# Altium project AMC_FMC_Carrier v3.PrjPcb (part 11 of 15)

## Sheet JTAG_Configuration.SchDoc
size A4; DocumentNumber: 8; SheetNumber: 8; SheetTotal: 30
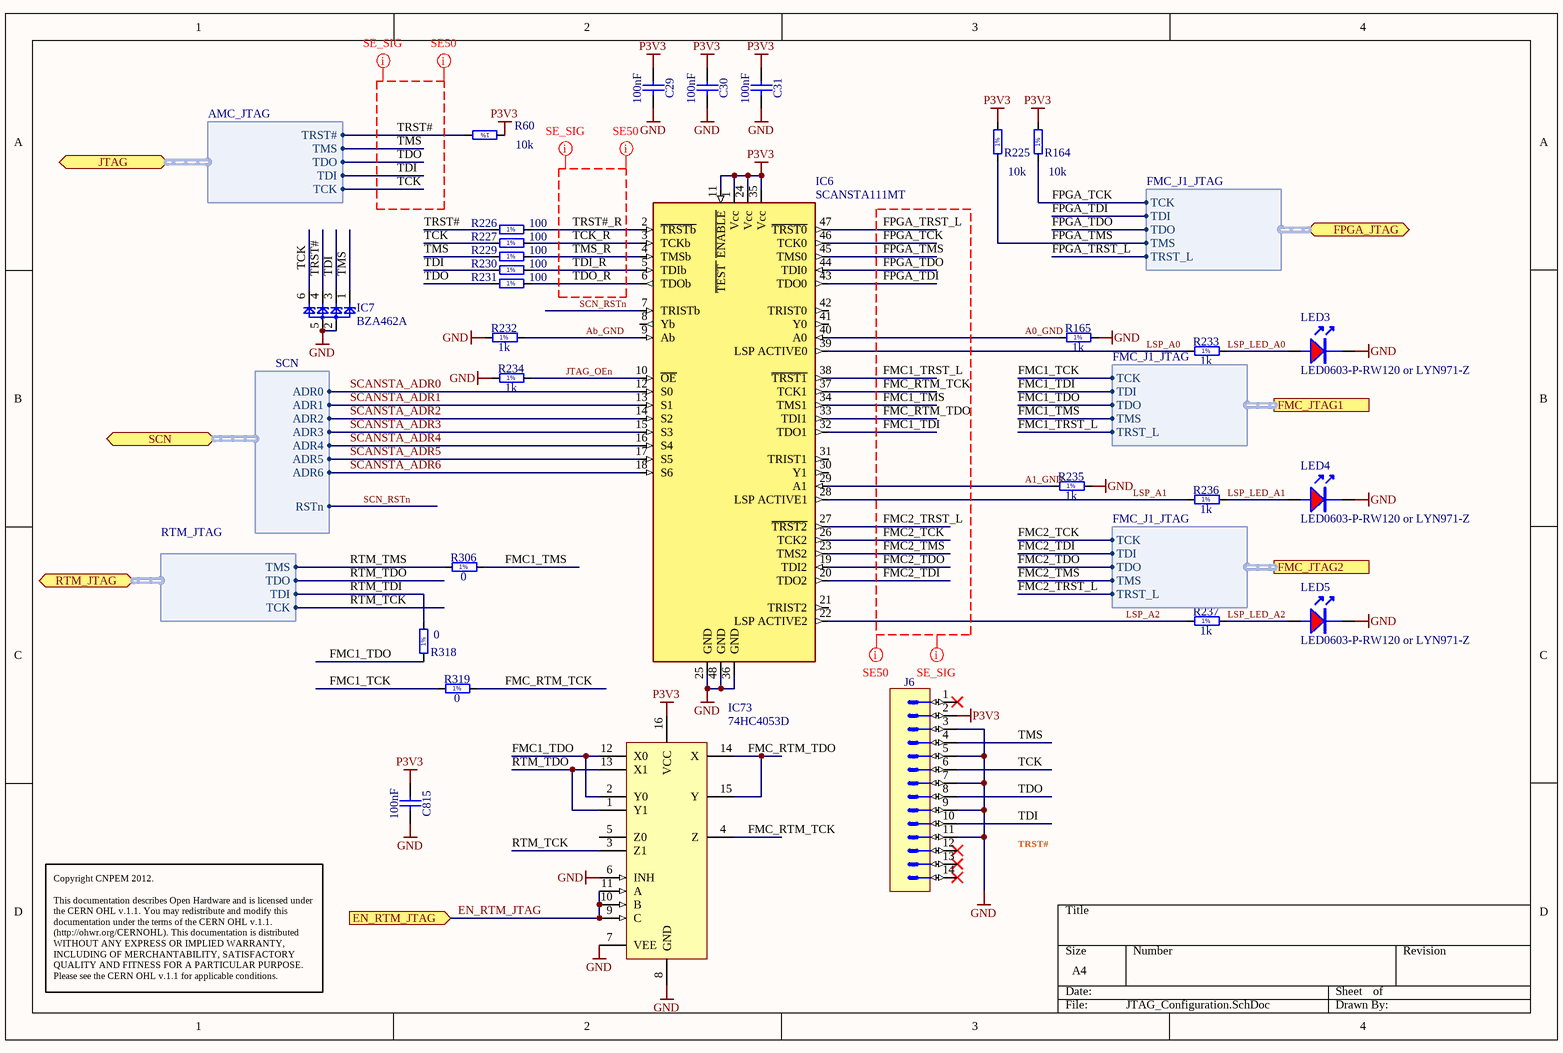
[diagram p25: JTAG_Configuration.SchDoc]

### Parts
C29  100nF  [CAPC0603X33N]
C30  100nF  [CAPC0603X33N]
C31  100nF  [CAPC0603X33N]
C815  100nF  [CAPC0603X33N]
IC6  SCANSTA111MT  [TSSOP-48]
IC7  BZA462A  [SOT23-6]
IC73  74HC4053D  [SO-16]
J6  Milli-Grid™  [MOLEX_87832-1420]  (value not drawn)
LED3  LED0603-P-RW120 or LYN971-Z  [led_0603R]
LED4  LED0603-P-RW120 or LYN971-Z  [led_0603R]
LED5  LED0603-P-RW120 or LYN971-Z  [led_0603R]
R60  10k  [RESC1005X40N]
R164  10k  [RESC1005X40N]
R165  1k  [RESC1005X40N]
R225  10k  [RESC1005X40N]
R226  100  [RESC1005X40N]
R227  100  [RESC1005X40N]
R229  100  [RESC1005X40N]
R230  100  [RESC1005X40N]
R231  100  [RESC1005X40N]
R232  1k  [RESC1005X40N]
R233  1k  [RESC1005X40N]
R234  1k  [RESC1005X40N]
R235  1k  [RESC1005X40N]
R236  1k  [RESC1005X40N]
R237  1k  [RESC1005X40N]
R306  0  [RESC1005X40N]
R318  0  [RESC1005X40N]
R319  0  [RESC1005X40N]

### Ports
EN_RTM_JTAG (in), FMC_JTAG1 (harness FMC_J1_JTAG), FMC_JTAG2 (harness FMC_J1_JTAG), FPGA_JTAG (harness FMC_J1_JTAG), JTAG (harness AMC_JTAG), RTM_JTAG (harness RTM_JTAG), SCN (harness SCN)

### Harnesses
FMC_J1_JTAG: TCK, TDI, TDO, TMS, TRST_L
AMC_JTAG: TCK, TDI, TDO, TMS, TRST#
SCN: ADR0, ADR1, ADR2, ADR3, ADR4, ADR5, ADR6, RSTn
RTM_JTAG: TCK, TDI, TDO, TMS

### Nets
GND: C29.2 C30.2 C31.2 C815.2 IC6.25(GND) IC6.36(GND) IC6.48(GND) IC7.2 IC7.5 IC73.6(INH) IC73.7(VEE) IC73.8(GND) J6.3 J6.5 J6.7 J6.9 J6.11 LED3.K LED4.K LED5.K R165.2 R232.1 R234.1 R235.2
P3V3: C29.1 C30.1 C31.1 C815.1 IC6.1(Vcc) IC6.11(~{TEST_}_~{ENABLE}) IC6.24(Vcc) IC6.35(Vcc) IC73.16(VCC) J6.2 R60.1 R164.2 R225.2
A0_GND: IC6.40(A0) R165.1
A1_GND: IC6.29(A1) R235.1
Ab_GND: IC6.9(Ab) R232.2
EN_RTM_JTAG: IC73.9(C) IC73.10(B) IC73.11(A) ; port EN_RTM_JTAG  [project net EN_I2C_RTM]
FMC1_TCK: R319.1 ; port FMC_JTAG1.TCK  [project net JTAG1.TCK]
FMC1_TDI: IC6.32(TDO1) ; port FMC_JTAG1.TDI  [project net JTAG1.TDI]
FMC1_TDO: IC73.2(Y0) IC73.12(X0) R318.1 ; port FMC_JTAG1.TDO  [project net JTAG1.TDO]
FMC1_TMS: IC6.34(TMS1) R306.2 ; port FMC_JTAG1.TMS  [project net JTAG1.TMS]
FMC1_TRST_L: IC6.38(~{TRST1}) ; port FMC_JTAG1.TRST_L  [project net JTAG1.TRST_L]
FMC2_TCK: IC6.26(TCK2) ; port FMC_JTAG2.TCK  [project net JTAG2.TCK]
FMC2_TDI: IC6.20(TDO2) ; port FMC_JTAG2.TDI  [project net JTAG2.TDI]
FMC2_TDO: IC6.19(TDI2) ; port FMC_JTAG2.TDO  [project net JTAG2.TDO]
FMC2_TMS: IC6.23(TMS2) ; port FMC_JTAG2.TMS  [project net JTAG2.TMS]
FMC2_TRST_L: IC6.27(~{TRST2}) ; port FMC_JTAG2.TRST_L  [project net JTAG2.TRST_L]
FMC_RTM_TCK: IC6.37(TCK1) IC73.4(Z) R319.2
FMC_RTM_TDO: IC6.33(TDI1) IC73.14(X) IC73.15(Y)
FPGA_TCK: IC6.46(TCK0) R164.1 ; port FPGA_JTAG.TCK  [project net FJTAG.TCK]
FPGA_TDI: IC6.43(TDO0) ; port FPGA_JTAG.TDI  [project net FJTAG.TDI]
FPGA_TDO: IC6.44(TDI0) ; port FPGA_JTAG.TDO  [project net FJTAG.TDO]
FPGA_TMS: IC6.45(TMS0) R225.1 ; port FPGA_JTAG.TMS  [project net FJTAG.TMS]
FPGA_TRST_L: IC6.47(~{TRST0}) ; port FPGA_JTAG.TRST_L  [project net FJTAG.TRST_L]
JTAG_OEn: IC6.10(~{OE}) R234.2
LSP_A0: IC6.39(LSP_ACTIVE0) R233.1
LSP_A1: IC6.28(LSP_ACTIVE1) R236.1
LSP_A2: IC6.22(LSP_ACTIVE2) R237.1
LSP_LED_A0: LED3.A R233.2
LSP_LED_A1: LED4.A R236.2
LSP_LED_A2: LED5.A R237.2
RTM_TCK: IC73.3(Z1) ; port RTM_JTAG.TCK
RTM_TDI: R318.2 ; port RTM_JTAG.TDI
RTM_TDO: IC73.1(Y1) IC73.13(X1) ; port RTM_JTAG.TDO
RTM_TMS: R306.1 ; port RTM_JTAG.TMS
SCANSTA_ADR0: IC6.12(S0) ; port SCN.ADR0  [project net SCN.ADR0]
SCANSTA_ADR1: IC6.13(S1) ; port SCN.ADR1  [project net SCN.ADR1]
SCANSTA_ADR2: IC6.14(S2) ; port SCN.ADR2  [project net SCN.ADR2]
SCANSTA_ADR3: IC6.15(S3) ; port SCN.ADR3  [project net SCN.ADR3]
SCANSTA_ADR4: IC6.16(S4) ; port SCN.ADR4  [project net SCN.ADR4]
SCANSTA_ADR5: IC6.17(S5) ; port SCN.ADR5  [project net SCN.ADR5]
SCANSTA_ADR6: IC6.18(S6) ; port SCN.ADR6  [project net SCN.ADR6]
SCN_RSTn: IC6.7(TRISTb) ; port SCN.RSTn  [project net SCN.RSTn]
TCK: IC7.6 J6.6 R227.1 ; port JTAG.TCK  [project net AJTAG.TCK]
TCK_R: IC6.3(TCKb) R227.2
TDI: IC7.3 J6.10 R230.1 ; port JTAG.TDI  [project net AJTAG.TDI]
TDI_R: IC6.5(TDIb) R230.2
TDO: J6.8 R231.1 ; port JTAG.TDO  [project net AJTAG.TDO]
TDO_R: IC6.6(TDOb) R231.2
TMS: IC7.1 J6.4 R229.1 ; port JTAG.TMS  [project net AJTAG.TMS]
TMS_R: IC6.4(TMSb) R229.2
TRST#: IC7.4 R60.2 R226.1 ; port JTAG.TRST#  [project net AJTAG.TRST#]
TRST#_R: IC6.2(~{TRSTb}) R226.2

Not connected (* = marked no-connect by the designer): IC6 8(Yb) 21(TRIST2) 30(Y1) 31(TRIST1) 41(Y0) 42(TRIST0); IC73 5(Z0); J6 1* 12* 13* 14*

### Layout directives
net class SE_SIG: FMC1_TDI, FMC1_TMS, FMC1_TRST_L, FMC2_TCK, FMC2_TDI, FMC2_TDO, FMC2_TMS, FMC2_TRST_L, FMC_RTM_TCK, FMC_RTM_TDO, FPGA_TCK, FPGA_TDI, FPGA_TDO, FPGA_TMS, FPGA_TRST_L, TCK, TCK_R, TDI, TDI_R, TDO, TDO_R, TMS, TMS_R, TRST#, TRST#_R
net class SE50: FMC1_TDI, FMC1_TMS, FMC1_TRST_L, FMC2_TCK, FMC2_TDI, FMC2_TDO, FMC2_TMS, FMC2_TRST_L, FMC_RTM_TCK, FMC_RTM_TDO, FPGA_TCK, FPGA_TDI, FPGA_TDO, FPGA_TMS, FPGA_TRST_L, TCK, TCK_R, TDI, TDI_R, TDO, TDO_R, TMS, TMS_R, TRST#, TRST#_R

### Notes on the sheet
- TRST#
- Copyright CNPEM 2012.
  This documentation describes Open Hardware and is licensed under the CERN OHL v.1.1. You may redistribute and modify this documentation under the terms of the CERN OHL v.1.1. (http://ohwr.org/CERNOHL). This documentation is distributed WITHOUT ANY EXPRESS OR IMPLIED WARRANTY, INCLUDING OF MERCHANTABILITY, SATISFACTORY QUALITY AND FITNESS FOR A PARTICULAR PURPOSE. Please see the CERN OHL v.1.1 for applicable conditions.
- (in symbol R0402_0R_JUMPER) 1%
- (in symbol R0402_1K_1%_0.0625W_100PPM) 1%
- (in symbol R0402_10K_1%_0.0625W_100PPM) 1%
- (in symbol R0402_100R_1%_0.0625W_100PPM) 1%

### Library data of the parts
C29-C31 C815 = CC0201_100NF_6.3V_10%_X5R: as C776 on sheet IPMI; Part Number: CC0201_100NF_6.3V_10%_X5R; Component Kind: Standard; Component Type: Standard; Pin Count: 2; Value: 100nF; Status: Not Recommended; Manufacturer Part Number: CC0201_100NF_6.3V_10%_X5R; Case: 0201; Mounted: Yes; Socket: No; SMD: Yes; Manufacturer1 Example: AVX; Manufacturer1 ComponentHeight: 0.33mm; HelpURL: \\cern.ch\dfs\Applications\Altium\Datasheets\CC0201_X5R_AVX.pdf; Author: CERN DEM JLC; CreateDate: 2007-12-03; LatestRevisionDate: 2007-12-03
IC6 = IFC_SCANSTA111: Enhanced SCAN Bridge Multidrop Addressable IEEE 1149.1 (JTAG) Port; Supplier 1: Digi-Key; Supplier Part Number 1: SCANSTA111MT-ND
IC7 = D_TVS_BZA462A: as IC4 on sheet CPU; Supplier 1: Newark; Supplier Part Number 1: 79R1868
IC73 = 4053
J6 = MOLEX_87832-1420: Connector 14 Male; Part Description: 2.00mm (.079") Pitch Milli-Grid™ Header, Surface Mount, Vertical, Shrouded, 14 Circuits,with Locking Windows and Centre Polarization Slot, PCB Locator; Manufacturer: MOLEX; Part Number: MOLEX_87832-1420; Component Kind: Standard; Component Type: Standard; Pin Count: 14; Family: Milli-Grid™; Mounted: Yes; Socket: No; SMD: Yes; Status: None; Manufacturer Part Number: 87832-1420; ComponentHeight: 6.4mm; HelpURL: \\cern.ch\dfs\Applications\Altium\Datasheets\MOLEX_87832-1420.pdf; Author: CERN DEM JLC; CreateDate: 2008-09-09; LatestRevisionDate: 2008-09-09; Table: MOLEX
LED3-LED5 = LED_0603R: LED 0603 red; Supplier 1: Newark; Supplier Part Number 1: 22M3004
R60 R164 R225 = R0402_10K_1%_0.0625W_100PPM: as R2-R6 on sheet CPU; Part Number: R0402_10K_1%_0.0625W_100PPM; Component Kind: Standard; Component Type: Standard; Pin Count: 2; Value: 10k; Status: Not recommended; Power: 0.0625W; Tolerance: ±1%; Manufacturer Part Number: R0402_10K_1%_0.0625W_100PPM; Case: 0402; Mounted: Yes; Socket: No; SMD: Yes; Manufacturer1 Example: YAGEO PHYCOMP; Manufacturer1 ComponentHeight: 0.4mm; HelpURL: \\cern.ch\dfs\Applications\Altium\Datasheets\R0402_Phycomp_RC0402.pdf; Author: CERN DEM JLC; CreateDate: 2007-12-03; LatestRevisionDate: 2012-10-17
R165 R232-R237 = R0402_1K_1%_0.0625W_100PPM: Resistor - 1%; Part Description: General Purpose Thick Film Chip Resistor; Manufacturer: GENERIC; Manufacturer1 Part Number: 232270671002L; TC: ±100ppm/°C; Table: Resistors SMD; Part Number: R0402_1K_1%_0.0625W_100PPM; Component Kind: Standard; Component Type: Standard; Pin Count: 2; Value: 1k; Status: Not recommended; Power: 0.0625W; Tolerance: ±1%; Manufacturer Part Number: R0402_1K_1%_0.0625W_100PPM; Case: 0402; Mounted: Yes; Socket: No; SMD: Yes; Manufacturer1 Example: YAGEO PHYCOMP; Manufacturer1 ComponentHeight: 0.4mm; HelpURL: \\cern.ch\dfs\Applications\Altium\Datasheets\R0402_Phycomp_RC0402.pdf; Author: CERN DEM JLC; CreateDate: 2007-12-03; LatestRevisionDate: 2012-10-17
R226 R227 R229-R231 = R0402_100R_1%_0.0625W_100PPM: as R1 on sheet CPU; Part Number: R0402_100R_1%_0.0625W_100PPM; Component Kind: Standard; Component Type: Standard; Pin Count: 2; Value: 100; Status: Not recommended; Power: 0.0625W; Tolerance: ±1%; Manufacturer Part Number: R0402_100R_1%_0.0625W_100PPM; Case: 0402; Mounted: Yes; Socket: No; SMD: Yes; Manufacturer1 Example: YAGEO PHYCOMP; Manufacturer1 ComponentHeight: 0.4mm; HelpURL: \\cern.ch\dfs\Applications\Altium\Datasheets\R0402_Phycomp_RC0402.pdf; Author: CERN DEM JLC; CreateDate: 2007-12-03; LatestRevisionDate: 2012-10-17
R306 R318 R319 = R0402_0R_JUMPER: Resistor - 1%; Part Description: 1A (0.05R Max DC Resistance) Zero Ohm Jumper; Manufacturer: GENERIC; Manufacturer1 Part Number: 232270591001L; Table: Resistors SMD; Part Number: R0402_0R_JUMPER; Component Kind: Standard; Component Type: Standard; Pin Count: 2; Value: 0; Status: Not recommended; Manufacturer Part Number: R0402_0R_JUMPER; Case: 0402; Mounted: Yes; Socket: No; SMD: Yes; Manufacturer1 Example: YAGEO PHYCOMP; Manufacturer1 ComponentHeight: 0.4mm; HelpURL: \\cern.ch\dfs\Applications\Altium\Datasheets\R0402_Phycomp_RC0402.pdf; Author: CERN DEM JLC; CreateDate: 2007-12-03; LatestRevisionDate: 2012-10-17

## Sheet RTM_CON.SchDoc
size A3; DocumentNumber: 21; SheetNumber: 21; SheetTotal: 30
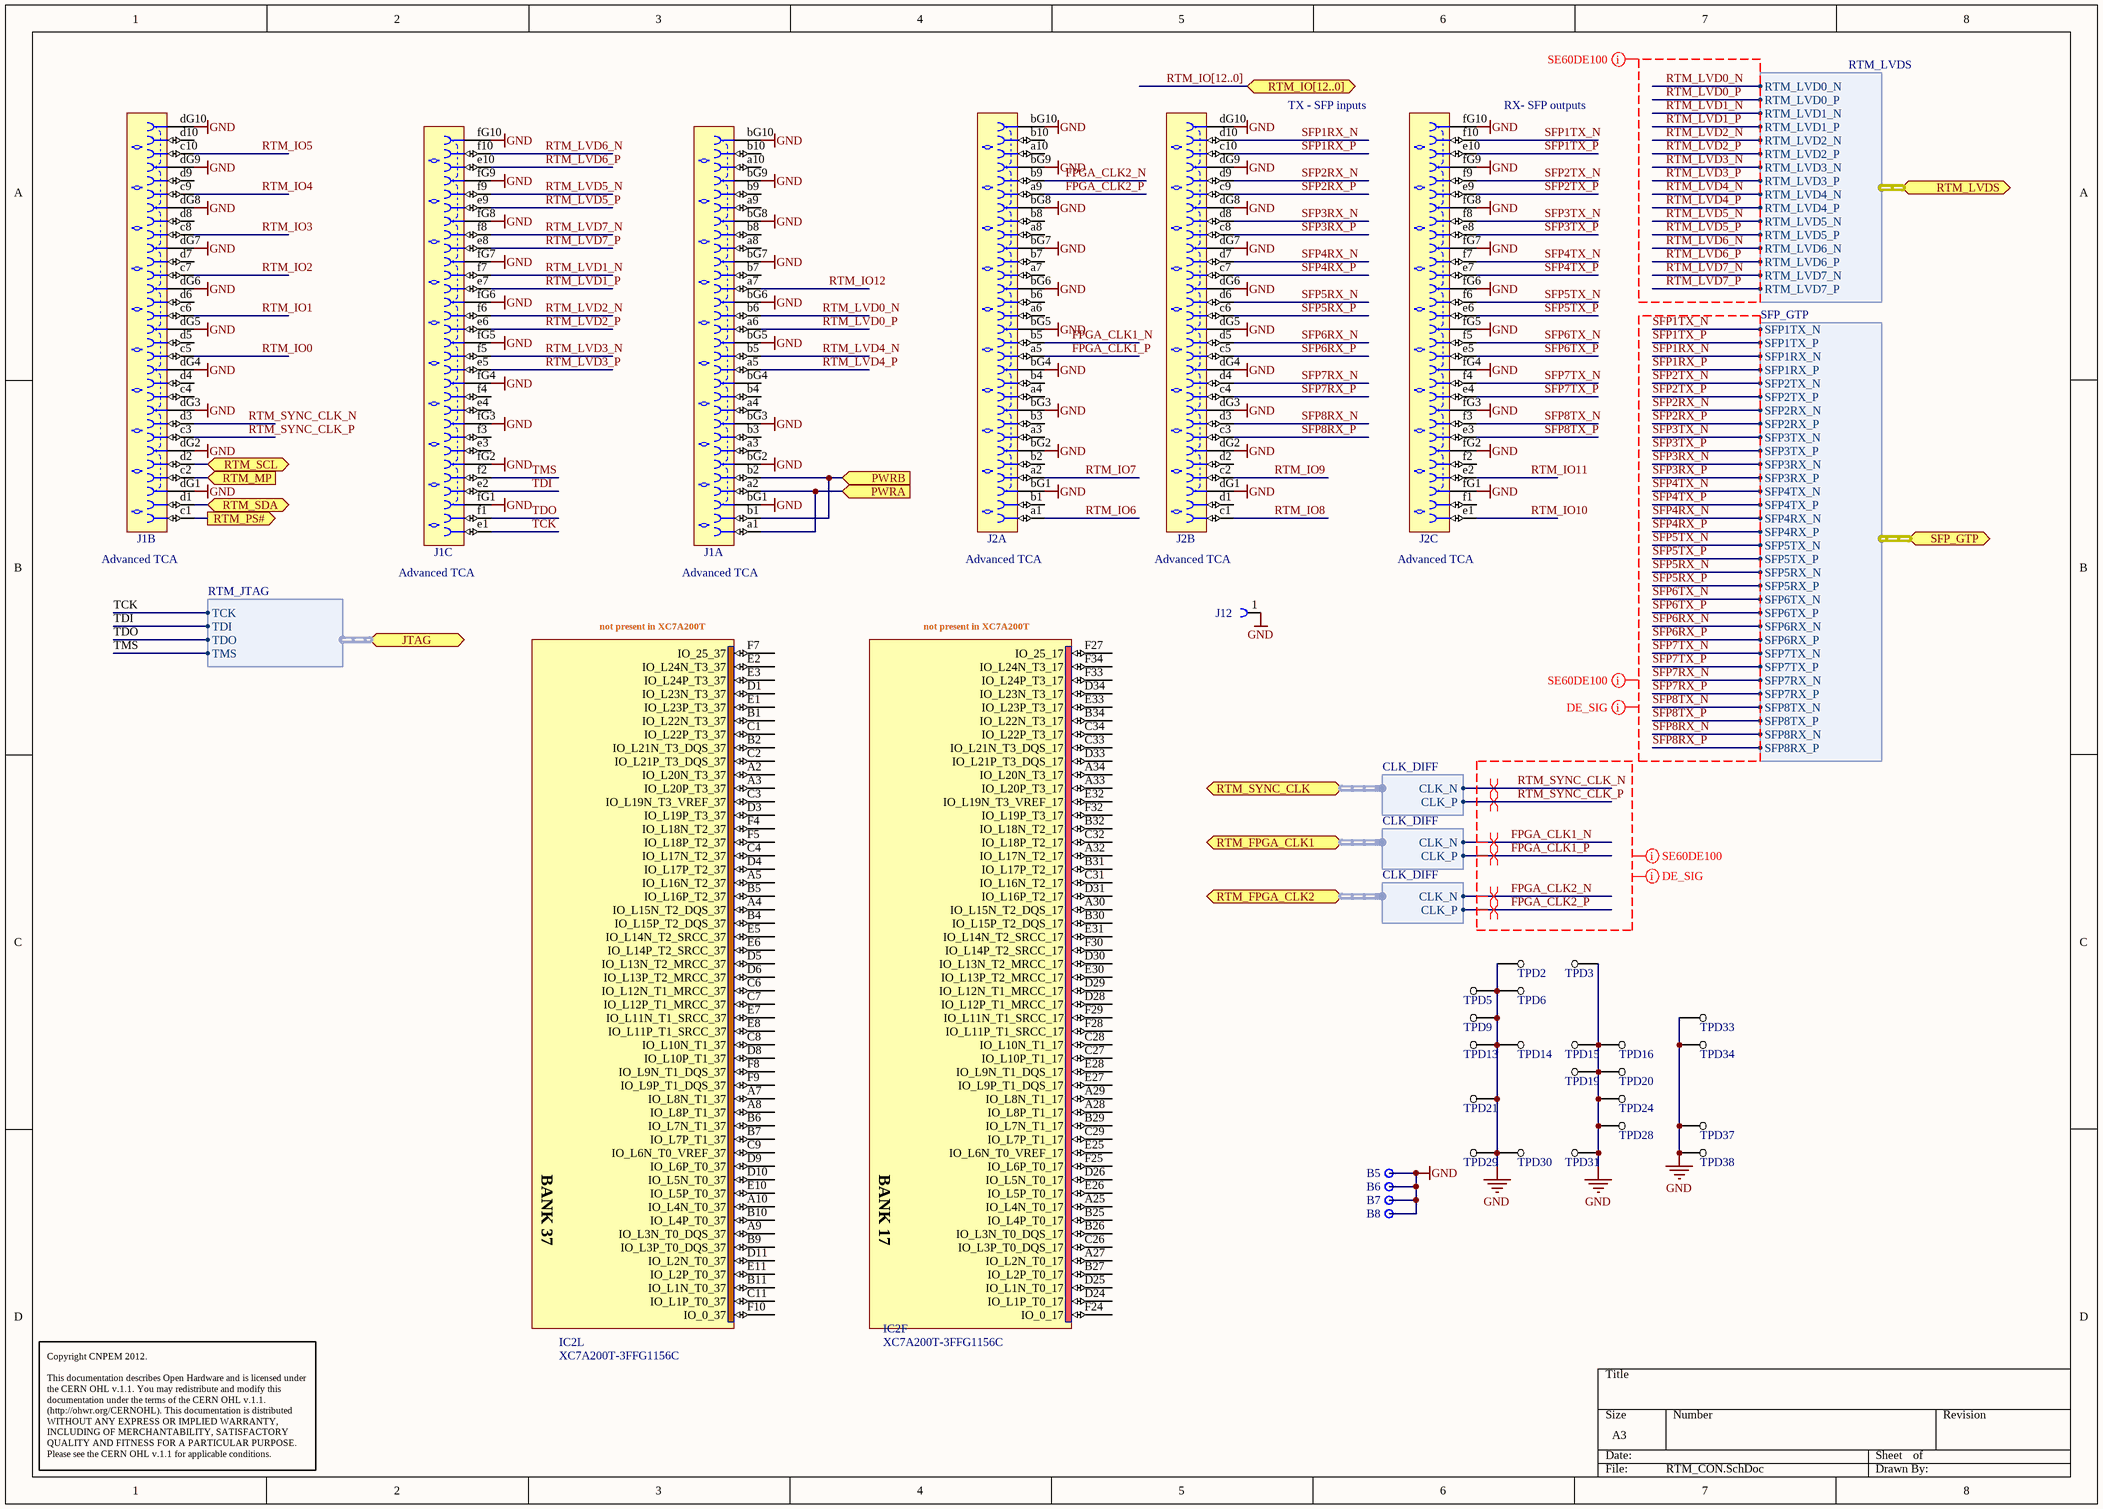
[diagram p26: RTM_CON.SchDoc]

### Parts
(Parts that share a designator on the sheet are numbered #1, #2 ... from top to bottom, then left to right.)
B5  Test Point  [VERO_20-2136]  (value not drawn)
B6  Test Point  [VERO_20-2136]  (value not drawn)
B7  Test Point  [VERO_20-2136]  (value not drawn)
B8  Test Point  [VERO_20-2136]  (value not drawn)
IC2#2  XC7A200T-3FFG1156C  [BGA1156C100P34X34_3500X3500X335]  (parts F,L of 23)
J1  Advanced TCA  [TYCO_6469081-1]  (parts A,B,C of 3)
J2  Advanced TCA  [TYCO_6469081-1]  (parts A,B,C of 3)
J12  (no value)  [TYCO_5120913-1]
TPD2  Test Point  [TP_DIFF_0805]  (value not drawn)
TPD3  Test Point  [TP_DIFF_0805]  (value not drawn)
TPD5  Test Point  [TP_DIFF_0805]  (value not drawn)
TPD6  Test Point  [TP_DIFF_0805]  (value not drawn)
TPD9  Test Point  [TP_DIFF_0805]  (value not drawn)
TPD13  Test Point  [TP_DIFF_0805]  (value not drawn)
TPD14  Test Point  [TP_DIFF_0805]  (value not drawn)
TPD15  Test Point  [TP_DIFF_0805]  (value not drawn)
TPD16  Test Point  [TP_DIFF_0805]  (value not drawn)
TPD19  Test Point  [TP_DIFF_0805]  (value not drawn)
TPD20  Test Point  [TP_DIFF_0805]  (value not drawn)
TPD21  Test Point  [TP_DIFF_0805]  (value not drawn)
TPD24  Test Point  [TP_DIFF_0805]  (value not drawn)
TPD28  Test Point  [TP_DIFF_0805]  (value not drawn)
TPD29  Test Point  [TP_DIFF_0805]  (value not drawn)
TPD30  Test Point  [TP_DIFF_0805]  (value not drawn)
TPD31  Test Point  [TP_DIFF_0805]  (value not drawn)
TPD33  Test Point  [TP_DIFF_0805]  (value not drawn)
TPD34  Test Point  [TP_DIFF_0805]  (value not drawn)
TPD37  Test Point  [TP_DIFF_0805]  (value not drawn)
TPD38  Test Point  [TP_DIFF_0805]  (value not drawn)

### Ports
JTAG (harness RTM_JTAG), PWRA (in), PWRB (in), RTM_FPGA_CLK1 (harness CLK_DIFF), RTM_FPGA_CLK2 (harness CLK_DIFF), RTM_IO[12..0] (bidir, harness JTAG), RTM_LVDS (harness RTM_LVDS), RTM_MP (in), RTM_PS# (out), RTM_SCL (bidir), RTM_SDA (bidir), RTM_SYNC_CLK (harness CLK_DIFF), SFP_GTP (harness SFP_GTP)

### Harnesses
RTM_LVDS: RTM_LVD0_N, RTM_LVD0_P, RTM_LVD1_N, RTM_LVD1_P, RTM_LVD2_N, RTM_LVD2_P, RTM_LVD3_N, RTM_LVD3_P, RTM_LVD4_N, RTM_LVD4_P, RTM_LVD5_N, RTM_LVD5_P, RTM_LVD6_N, RTM_LVD6_P, RTM_LVD7_N, RTM_LVD7_P
SFP_GTP: SFP1RX_N, SFP1RX_P, SFP1TX_N, SFP1TX_P, SFP2TX_N, SFP2TX_P, SFP2RX_N, SFP2RX_P, SFP3TX_N, SFP3TX_P, SFP3RX_N, SFP3RX_P, SFP4TX_N, SFP4TX_P, SFP4RX_N, SFP4RX_P, SFP5TX_N, SFP5TX_P, SFP5RX_N, SFP5RX_P, SFP6TX_N, SFP6TX_P, SFP6RX_N, SFP6RX_P, SFP7TX_N, SFP7TX_P, SFP7RX_N, SFP7RX_P, SFP8TX_N, SFP8TX_P, SFP8RX_N, SFP8RX_P
RTM_JTAG: TCK, TDI, TDO, TMS
CLK_DIFF: CLK_P, CLK_N

### Nets
GND: B5.1 B6.1 B7.1 B8.1 J1.bG1 J1.bG2 J1.bG3 J1.bG5 J1.bG6 J1.bG7 J1.bG8 J1.bG9 J1.bG10 J1.dG1 J1.dG2 J1.dG3 J1.dG4 J1.dG5 J1.dG6 J1.dG7 J1.dG8 J1.dG9 J1.dG10 J1.fG1 J1.fG2 J1.fG3 J1.fG4 J1.fG5 J1.fG6 J1.fG7 J1.fG8 J1.fG9 J1.fG10 J2.bG1 J2.bG2 J2.bG3 J2.bG4 J2.bG5 J2.bG6 J2.bG7 J2.bG8 J2.bG9 J2.bG10 J2.dG1 J2.dG2 J2.dG3 J2.dG4 J2.dG5 J2.dG6 J2.dG7 J2.dG8 J2.dG9 J2.dG10 J2.fG1 J2.fG2 J2.fG3 J2.fG4 J2.fG5 J2.fG6 J2.fG7 J2.fG8 J2.fG9 J2.fG10 J12.1 TPD2.1(TP) TPD3.1(TP) TPD5.1(TP) TPD6.1(TP) TPD9.1(TP) TPD13.1(TP) TPD14.1(TP) TPD15.1(TP) TPD16.1(TP) TPD19.1(TP) TPD20.1(TP) TPD21.1(TP) TPD24.1(TP) TPD28.1(TP) TPD29.1(TP) TPD30.1(TP) TPD31.1(TP) TPD33.1(TP) TPD34.1(TP) TPD37.1(TP) TPD38.1(TP)
FPGA_CLK1_N: J2.b5 ; port RTM_FPGA_CLK1.CLK_N
FPGA_CLK1_P: J2.a5 ; port RTM_FPGA_CLK1.CLK_P
FPGA_CLK2_N: J2.b9 ; port RTM_FPGA_CLK2.CLK_N
FPGA_CLK2_P: J2.a9 ; port RTM_FPGA_CLK2.CLK_P
PWRA: J1.a1 J1.a2 J1.b1 J1.b2 ; port PWRA, port PWRB
RTM_IO0: J1.c5
RTM_IO1: J1.c6
RTM_IO2: J1.c7
RTM_IO3: J1.c8
RTM_IO4: J1.c9
RTM_IO5: J1.c10
RTM_IO6: J2.a1
RTM_IO7: J2.a2
RTM_IO8: J2.c1
RTM_IO9: J2.c2
RTM_IO10: J2.e1
RTM_IO11: J2.e2
RTM_IO12: J1.a7
RTM_LVD0_N: J1.b6 ; port RTM_LVDS.RTM_LVD0_N  [project net RTM_LVDS.RTM_LVD0_N]
RTM_LVD0_P: J1.a6 ; port RTM_LVDS.RTM_LVD0_P  [project net RTM_LVDS.RTM_LVD0_P]
RTM_LVD1_N: J1.f7 ; port RTM_LVDS.RTM_LVD1_N  [project net RTM_LVDS.RTM_LVD1_N]
RTM_LVD1_P: J1.e7 ; port RTM_LVDS.RTM_LVD1_P  [project net RTM_LVDS.RTM_LVD1_P]
RTM_LVD2_N: J1.f6 ; port RTM_LVDS.RTM_LVD2_N  [project net RTM_LVDS.RTM_LVD2_N]
RTM_LVD2_P: J1.e6 ; port RTM_LVDS.RTM_LVD2_P  [project net RTM_LVDS.RTM_LVD2_P]
RTM_LVD3_N: J1.f5 ; port RTM_LVDS.RTM_LVD3_N  [project net RTM_LVDS.RTM_LVD3_N]
RTM_LVD3_P: J1.e5 ; port RTM_LVDS.RTM_LVD3_P  [project net RTM_LVDS.RTM_LVD3_P]
RTM_LVD4_N: J1.b5 ; port RTM_LVDS.RTM_LVD4_N  [project net RTM_LVDS.RTM_LVD4_N]
RTM_LVD4_P: J1.a5 ; port RTM_LVDS.RTM_LVD4_P  [project net RTM_LVDS.RTM_LVD4_P]
RTM_LVD5_N: J1.f9 ; port RTM_LVDS.RTM_LVD5_N  [project net RTM_LVDS.RTM_LVD5_N]
RTM_LVD5_P: J1.e9 ; port RTM_LVDS.RTM_LVD5_P  [project net RTM_LVDS.RTM_LVD5_P]
RTM_LVD6_N: J1.f10 ; port RTM_LVDS.RTM_LVD6_N  [project net RTM_LVDS.RTM_LVD6_N]
RTM_LVD6_P: J1.e10 ; port RTM_LVDS.RTM_LVD6_P  [project net RTM_LVDS.RTM_LVD6_P]
RTM_LVD7_N: J1.f8 ; port RTM_LVDS.RTM_LVD7_N  [project net RTM_LVDS.RTM_LVD7_N]
RTM_LVD7_P: J1.e8 ; port RTM_LVDS.RTM_LVD7_P  [project net RTM_LVDS.RTM_LVD7_P]
RTM_MP: J1.c2 ; port RTM_MP
RTM_PS#: J1.c1 ; port RTM_PS#
RTM_SCL: J1.d2 ; port RTM_SCL
RTM_SDA: J1.d1 ; port RTM_SDA
RTM_SYNC_CLK_N: J1.d3 ; port RTM_SYNC_CLK.CLK_N
RTM_SYNC_CLK_P: J1.c3 ; port RTM_SYNC_CLK.CLK_P
SFP1RX_N: J2.d10 ; port SFP_GTP.SFP1RX_N  [project net SFP_GTP.SFP1RX_N]
SFP1RX_P: J2.c10 ; port SFP_GTP.SFP1RX_P  [project net SFP_GTP.SFP1RX_P]
SFP1TX_N: J2.f10 ; port SFP_GTP.SFP1TX_N  [project net SFP_GTP.SFP1TX_N]
SFP1TX_P: J2.e10 ; port SFP_GTP.SFP1TX_P  [project net SFP_GTP.SFP1TX_P]
SFP2RX_N: J2.d9 ; port SFP_GTP.SFP2RX_N  [project net SFP_GTP.SFP2RX_N]
SFP2RX_P: J2.c9 ; port SFP_GTP.SFP2RX_P  [project net SFP_GTP.SFP2RX_P]
SFP2TX_N: J2.f9 ; port SFP_GTP.SFP2TX_N  [project net SFP_GTP.SFP2TX_N]
SFP2TX_P: J2.e9 ; port SFP_GTP.SFP2TX_P  [project net SFP_GTP.SFP2TX_P]
SFP3RX_N: J2.d8 ; port SFP_GTP.SFP3RX_N  [project net SFP_GTP.SFP3RX_N]
SFP3RX_P: J2.c8 ; port SFP_GTP.SFP3RX_P  [project net SFP_GTP.SFP3RX_P]
SFP3TX_N: J2.f8 ; port SFP_GTP.SFP3TX_N  [project net SFP_GTP.SFP3TX_N]
SFP3TX_P: J2.e8 ; port SFP_GTP.SFP3TX_P  [project net SFP_GTP.SFP3TX_P]
SFP4RX_N: J2.d7 ; port SFP_GTP.SFP4RX_N  [project net SFP_GTP.SFP4RX_N]
SFP4RX_P: J2.c7 ; port SFP_GTP.SFP4RX_P  [project net SFP_GTP.SFP4RX_P]
SFP4TX_N: J2.f7 ; port SFP_GTP.SFP4TX_N  [project net SFP_GTP.SFP4TX_N]
SFP4TX_P: J2.e7 ; port SFP_GTP.SFP4TX_P  [project net SFP_GTP.SFP4TX_P]
SFP5RX_N: J2.d6 ; port SFP_GTP.SFP5RX_N  [project net SFP_GTP.SFP5RX_N]
SFP5RX_P: J2.c6 ; port SFP_GTP.SFP5RX_P  [project net SFP_GTP.SFP5RX_P]
SFP5TX_N: J2.f6 ; port SFP_GTP.SFP5TX_N  [project net SFP_GTP.SFP5TX_N]
SFP5TX_P: J2.e6 ; port SFP_GTP.SFP5TX_P  [project net SFP_GTP.SFP5TX_P]
SFP6RX_N: J2.d5 ; port SFP_GTP.SFP6RX_N  [project net SFP_GTP.SFP6RX_N]
SFP6RX_P: J2.c5 ; port SFP_GTP.SFP6RX_P  [project net SFP_GTP.SFP6RX_P]
SFP6TX_N: J2.f5 ; port SFP_GTP.SFP6TX_N  [project net SFP_GTP.SFP6TX_N]
SFP6TX_P: J2.e5 ; port SFP_GTP.SFP6TX_P  [project net SFP_GTP.SFP6TX_P]
SFP7RX_N: J2.d4 ; port SFP_GTP.SFP7RX_N  [project net SFP_GTP.SFP7RX_N]
SFP7RX_P: J2.c4 ; port SFP_GTP.SFP7RX_P  [project net SFP_GTP.SFP7RX_P]
SFP7TX_N: J2.f4 ; port SFP_GTP.SFP7TX_N  [project net SFP_GTP.SFP7TX_N]
SFP7TX_P: J2.e4 ; port SFP_GTP.SFP7TX_P  [project net SFP_GTP.SFP7TX_P]
SFP8RX_N: J2.d3 ; port SFP_GTP.SFP8RX_N  [project net SFP_GTP.SFP8RX_N]
SFP8RX_P: J2.c3 ; port SFP_GTP.SFP8RX_P  [project net SFP_GTP.SFP8RX_P]
SFP8TX_N: J2.f3 ; port SFP_GTP.SFP8TX_N  [project net SFP_GTP.SFP8TX_N]
SFP8TX_P: J2.e3 ; port SFP_GTP.SFP8TX_P  [project net SFP_GTP.SFP8TX_P]
TCK: J1.e1 ; port JTAG.TCK  [project net RTM_TCK]
TDI: J1.e2 ; port JTAG.TDI  [project net RTM_TDI]
TDO: J1.f1 ; port JTAG.TDO  [project net RTM_TDO]
TMS: J1.f2 ; port JTAG.TMS  [project net RTM_TMS]

Not connected (* = marked no-connect by the designer): IC2#2 A2(IO_L20N_T3_37) A3(IO_L20P_T3_37) A4(IO_L15N_T2_DQS_37) A5(IO_L16N_T2_37) A7(IO_L8N_T1_37) A8(IO_L8P_T1_37) A9(IO_L3N_T0_DQS_37) A10(IO_L4N_T0_37) A25(IO_L4N_T0_17) A27(IO_L2N_T0_17) A28(IO_L8P_T1_17) A29(IO_L8N_T1_17) A30(IO_L15N_T2_DQS_17) A32(IO_L17N_T2_17) A33(IO_L20P_T3_17) A34(IO_L20N_T3_17) B1(IO_L22N_T3_37) B2(IO_L21N_T3_DQS_37) B4(IO_L15P_T2_DQS_37) B5(IO_L16P_T2_37) B6(IO_L7N_T1_37) B7(IO_L7P_T1_37) B9(IO_L3P_T0_DQS_37) B10(IO_L4P_T0_37) B11(IO_L1N_T0_37) B25(IO_L4P_T0_17) B26(IO_L3N_T0_DQS_17) B27(IO_L2P_T0_17) B29(IO_L7N_T1_17) B30(IO_L15P_T2_DQS_17) B31(IO_L17P_T2_17) B32(IO_L18N_T2_17) B34(IO_L22N_T3_17) C1(IO_L22P_T3_37) C2(IO_L21P_T3_DQS_37) C3(IO_L19N_T3_VREF_37) C4(IO_L17N_T2_37) C6(IO_L12N_T1_MRCC_37) C7(IO_L12P_T1_MRCC_37) C8(IO_L10N_T1_37) C9(IO_L6N_T0_VREF_37) C11(IO_L1P_T0_37) C26(IO_L3P_T0_DQS_17) C27(IO_L10P_T1_17) C28(IO_L10N_T1_17) C29(IO_L7P_T1_17) C31(IO_L16N_T2_17) C32(IO_L18P_T2_17) C33(IO_L21N_T3_DQS_17) C34(IO_L22P_T3_17) D1(IO_L23N_T3_37) D3(IO_L19P_T3_37) D4(IO_L17P_T2_37) D5(IO_L13N_T2_MRCC_37) D6(IO_L13P_T2_MRCC_37) D8(IO_L10P_T1_37) D9(IO_L6P_T0_37) D10(IO_L5N_T0_37) D11(IO_L2N_T0_37) D24(IO_L1P_T0_17) D25(IO_L1N_T0_17) D26(IO_L5N_T0_17) D28(IO_L12P_T1_MRCC_17) D29(IO_L12N_T1_MRCC_17) D30(IO_L13N_T2_MRCC_17) D31(IO_L16P_T2_17) D33(IO_L21P_T3_DQS_17) D34(IO_L23N_T3_17) E1(IO_L23P_T3_37) E2(IO_L24N_T3_37) E3(IO_L24P_T3_37) E5(IO_L14N_T2_SRCC_37) E6(IO_L14P_T2_SRCC_37) E7(IO_L11N_T1_SRCC_37) E8(IO_L11P_T1_SRCC_37) E10(IO_L5P_T0_37) E11(IO_L2P_T0_37) E25(IO_L6N_T0_VREF_17) E26(IO_L5P_T0_17) E27(IO_L9P_T1_DQS_17) E28(IO_L9N_T1_DQS_17) E30(IO_L13P_T2_MRCC_17) E31(IO_L14N_T2_SRCC_17) E32(IO_L19N_T3_VREF_17) E33(IO_L23P_T3_17) F4(IO_L18N_T2_37) F5(IO_L18P_T2_37) F7(IO_25_37) F8(IO_L9N_T1_DQS_37) F9(IO_L9P_T1_DQS_37) F10(IO_0_37) F24(IO_0_17) F25(IO_L6P_T0_17) F27(IO_25_17) F28(IO_L11P_T1_SRCC_17) F29(IO_L11N_T1_SRCC_17) F30(IO_L14P_T2_SRCC_17) F32(IO_L19P_T3_17) F33(IO_L24P_T3_17) F34(IO_L24N_T3_17); J1 a3 a4 a8 a9 a10 b3 b4 b7 b8 b9 b10 bG4 c4 d4 d5 d6 d7 d8 d9 d10 e3 e4 f3 f4; J2 a3 a4 a6 a7 a8 a10 b1 b2 b3 b4 b6 b7 b8 b10 d1 d2 f1 f2

### Buses and harness runs
bus RTM_IO[12..0]

### Layout directives
net class SE60DE100: FPGA_CLK1_N, FPGA_CLK1_P, FPGA_CLK2_N, FPGA_CLK2_P, RTM_LVD0_N, RTM_LVD0_P, RTM_LVD1_N, RTM_LVD1_P, RTM_LVD2_N, RTM_LVD2_P, RTM_LVD3_N, RTM_LVD3_P, RTM_LVD4_N, RTM_LVD4_P, RTM_LVD5_N, RTM_LVD5_P, RTM_LVD6_N, RTM_LVD6_P, RTM_LVD7_N, RTM_LVD7_P, RTM_SYNC_CLK_N, RTM_SYNC_CLK_P, SFP1RX_N, SFP1RX_P, SFP1TX_N, SFP1TX_P, SFP2RX_N, SFP2RX_P, SFP2TX_N, SFP2TX_P, SFP3RX_N, SFP3RX_P, SFP3TX_N, SFP3TX_P, SFP4RX_N, SFP4RX_P, SFP4TX_N, SFP4TX_P, SFP5RX_N, SFP5RX_P, SFP5TX_N, SFP5TX_P, SFP6RX_N, SFP6RX_P, SFP6TX_N, SFP6TX_P, SFP7RX_N, SFP7RX_P, SFP7TX_N, SFP7TX_P, SFP8RX_N, SFP8RX_P, SFP8TX_N, SFP8TX_P
net class DE_SIG: FPGA_CLK1_N, FPGA_CLK1_P, FPGA_CLK2_N, FPGA_CLK2_P, RTM_SYNC_CLK_N, RTM_SYNC_CLK_P, SFP1RX_N, SFP1RX_P, SFP1TX_N, SFP1TX_P, SFP2RX_N, SFP2RX_P, SFP2TX_N, SFP2TX_P, SFP3RX_N, SFP3RX_P, SFP3TX_N, SFP3TX_P, SFP4RX_N, SFP4RX_P, SFP4TX_N, SFP4TX_P, SFP5RX_N, SFP5RX_P, SFP5TX_N, SFP5TX_P, SFP6RX_N, SFP6RX_P, SFP6TX_N, SFP6TX_P, SFP7RX_N, SFP7RX_P, SFP7TX_N, SFP7TX_P, SFP8RX_N, SFP8RX_P, SFP8TX_N, SFP8TX_P
differential pair: FPGA_CLK1_N, FPGA_CLK1_P, FPGA_CLK2_N, FPGA_CLK2_P, RTM_SYNC_CLK_N, RTM_SYNC_CLK_P

### Notes on the sheet
- TX - SFP inputs
- RX- SFP outputs
- (near IC2#2) not present in XC7A200T
- Copyright CNPEM 2012.
  This documentation describes Open Hardware and is licensed under the CERN OHL v.1.1. You may redistribute and modify this documentation under the terms of the CERN OHL v.1.1. (http://ohwr.org/CERNOHL). This documentation is distributed WITHOUT ANY EXPRESS OR IMPLIED WARRANTY, INCLUDING OF MERCHANTABILITY, SATISFACTORY QUALITY AND FITNESS FOR A PARTICULAR PURPOSE. Please see the CERN OHL v.1.1 for applicable conditions.
- (in symbol XC7A200T-3FFG1156C, part F) BANK 17
- (in symbol XC7A200T-3FFG1156C, part L) BANK 37
- (in symbol XC7A350T-2FFG1156C, part F) BANK 17
- (in symbol XC7A350T-2FFG1156C, part L) BANK 37

### Library data of the parts
B5-B8 = VERO_20-2136: Single Terminal Socket; Part Description: Black Bead PCB Terminal Test Pin (1.32 mm hole); Manufacturer: VERO TECHNOLOGIES; Table: Miscellaneous; Part Number: VERO_20-2136; Component Kind: Standard; Component Type: Standard; Pin Count: 1; Family: Test Point; Mounted: Yes; Socket: No; SMD: No; Status: None; Manufacturer Part Number: 20-2136; ComponentHeight: 5.3mm; HelpURL: \\cern.ch\dfs\Applications\Altium\Datasheets\VERO_20-2136.pdf; Author: CERN DEM JLC; CreateDate: 21/07/2008; LatestRevisionDate: 21/07/2008
IC2#2 = XC7A200T-3FFG1156C: Artix-6 FPGA, 16 GTPs, 600 User I/Os, 1156-Pin BGA, Speed Grade 2, Commercial Grade, Pb-Free; Part Description: Artix-7 FPGA, 16 GTPs, 600 User I/Os, 1156-Pin BGA, Speed Grade 2, Commercial Grade, Pb-Free; Manufacturer: XILINX; Table: Logic; Part Number: XC7A200T-3FFG1156C; Component Kind: Standard; Component Type: Standard; Device: XC7A200T-3FFG1156C; PackageDescription: BGA, 1.00mm Pitch, Square; 1156 Pin, 34 Columns X 34 Rows, 35.00mm X 35.00mm X 3.350mm H; Manufacturer Part Number: XC7A200T-3FFG1156C; Pin Count: 1156; Case: BGA1156; Mounted: Yes; Socket: No; SMD: Yes; ComponentHeight: 3.35mm; HelpURL: \\cern.ch\dfs\Applications\Altium\Datasheets\XC7A350T-2FFG1156C.pdf; ComponentLink1URL: \\cern.ch\dfs\Applications\Altium\Datasheets\XC7A350T-2FFG1156C.pdf; ComponentLink1Description: Package/Pinout; Author: CERN DEM JLC; CreateDate: 2012-09-19; LatestRevisionDate: 2012-09-19
J1 J2 = TYCO_6469081-1: Connector 60 ATCA Female 30 Pairs (60 Signals) + 3x10 Ground; Part Description: 60 Positions, Pitch 2.5mm,  Advanced TCA, Z-PACK HM-Zd Right Angle Press Fit Receptacle; Manufacturer: TYCO ELECTRONICS; Table: TYCO; Part Number: TYCO_6469081-1; Component Kind: Standard; Component Type: Standard; Pin Count: 90; Family: Advanced TCA; Mounted: Yes; Socket: No; SMD: No; Status: None; Manufacturer Part Number: 6469081-1; ComponentHeight: 12.18mm; HelpURL: \\cern.ch\dfs\Applications\Altium\Datasheets\TYCO_6469081-1.pdf; Author: CERN DEM JLC; CreateDate: 2013-08-28; LatestRevisionDate: 2013-08-28
J12 = TYCO_5120913-1: Single Pin Female; Part Number: TYCO_5120913-1
TPD2 TPD3 TPD5 TPD6 TPD9 TPD13-TPD16 TPD19-TPD21 TPD24 TPD28-TPD31 TPD33 TPD34 TPD37 TPD38 = TP_DIFF: 1625854-2; Bottom_EstimationX (mm): 0; Document Name: RTM_CON.SchDoc; Part Number: TP_DIFF; ParamsList: Test Point; FootprintSizeX (mm): 4; FootprintSizeY (mm): 2; FootprintRectangleArea (mm): 8; Thickness (Max) (mm): 2; Bottom_EstimationY (mm): 0; Bottom_Area_Estimation (mm): 0; FootprintAlias: TP_SMD_0805